# Altium schematic sheet CAMERA_DVP_FPC24_OV26407670.SchDoc
size A3; SheetNumber: 8; SheetTotal: 27
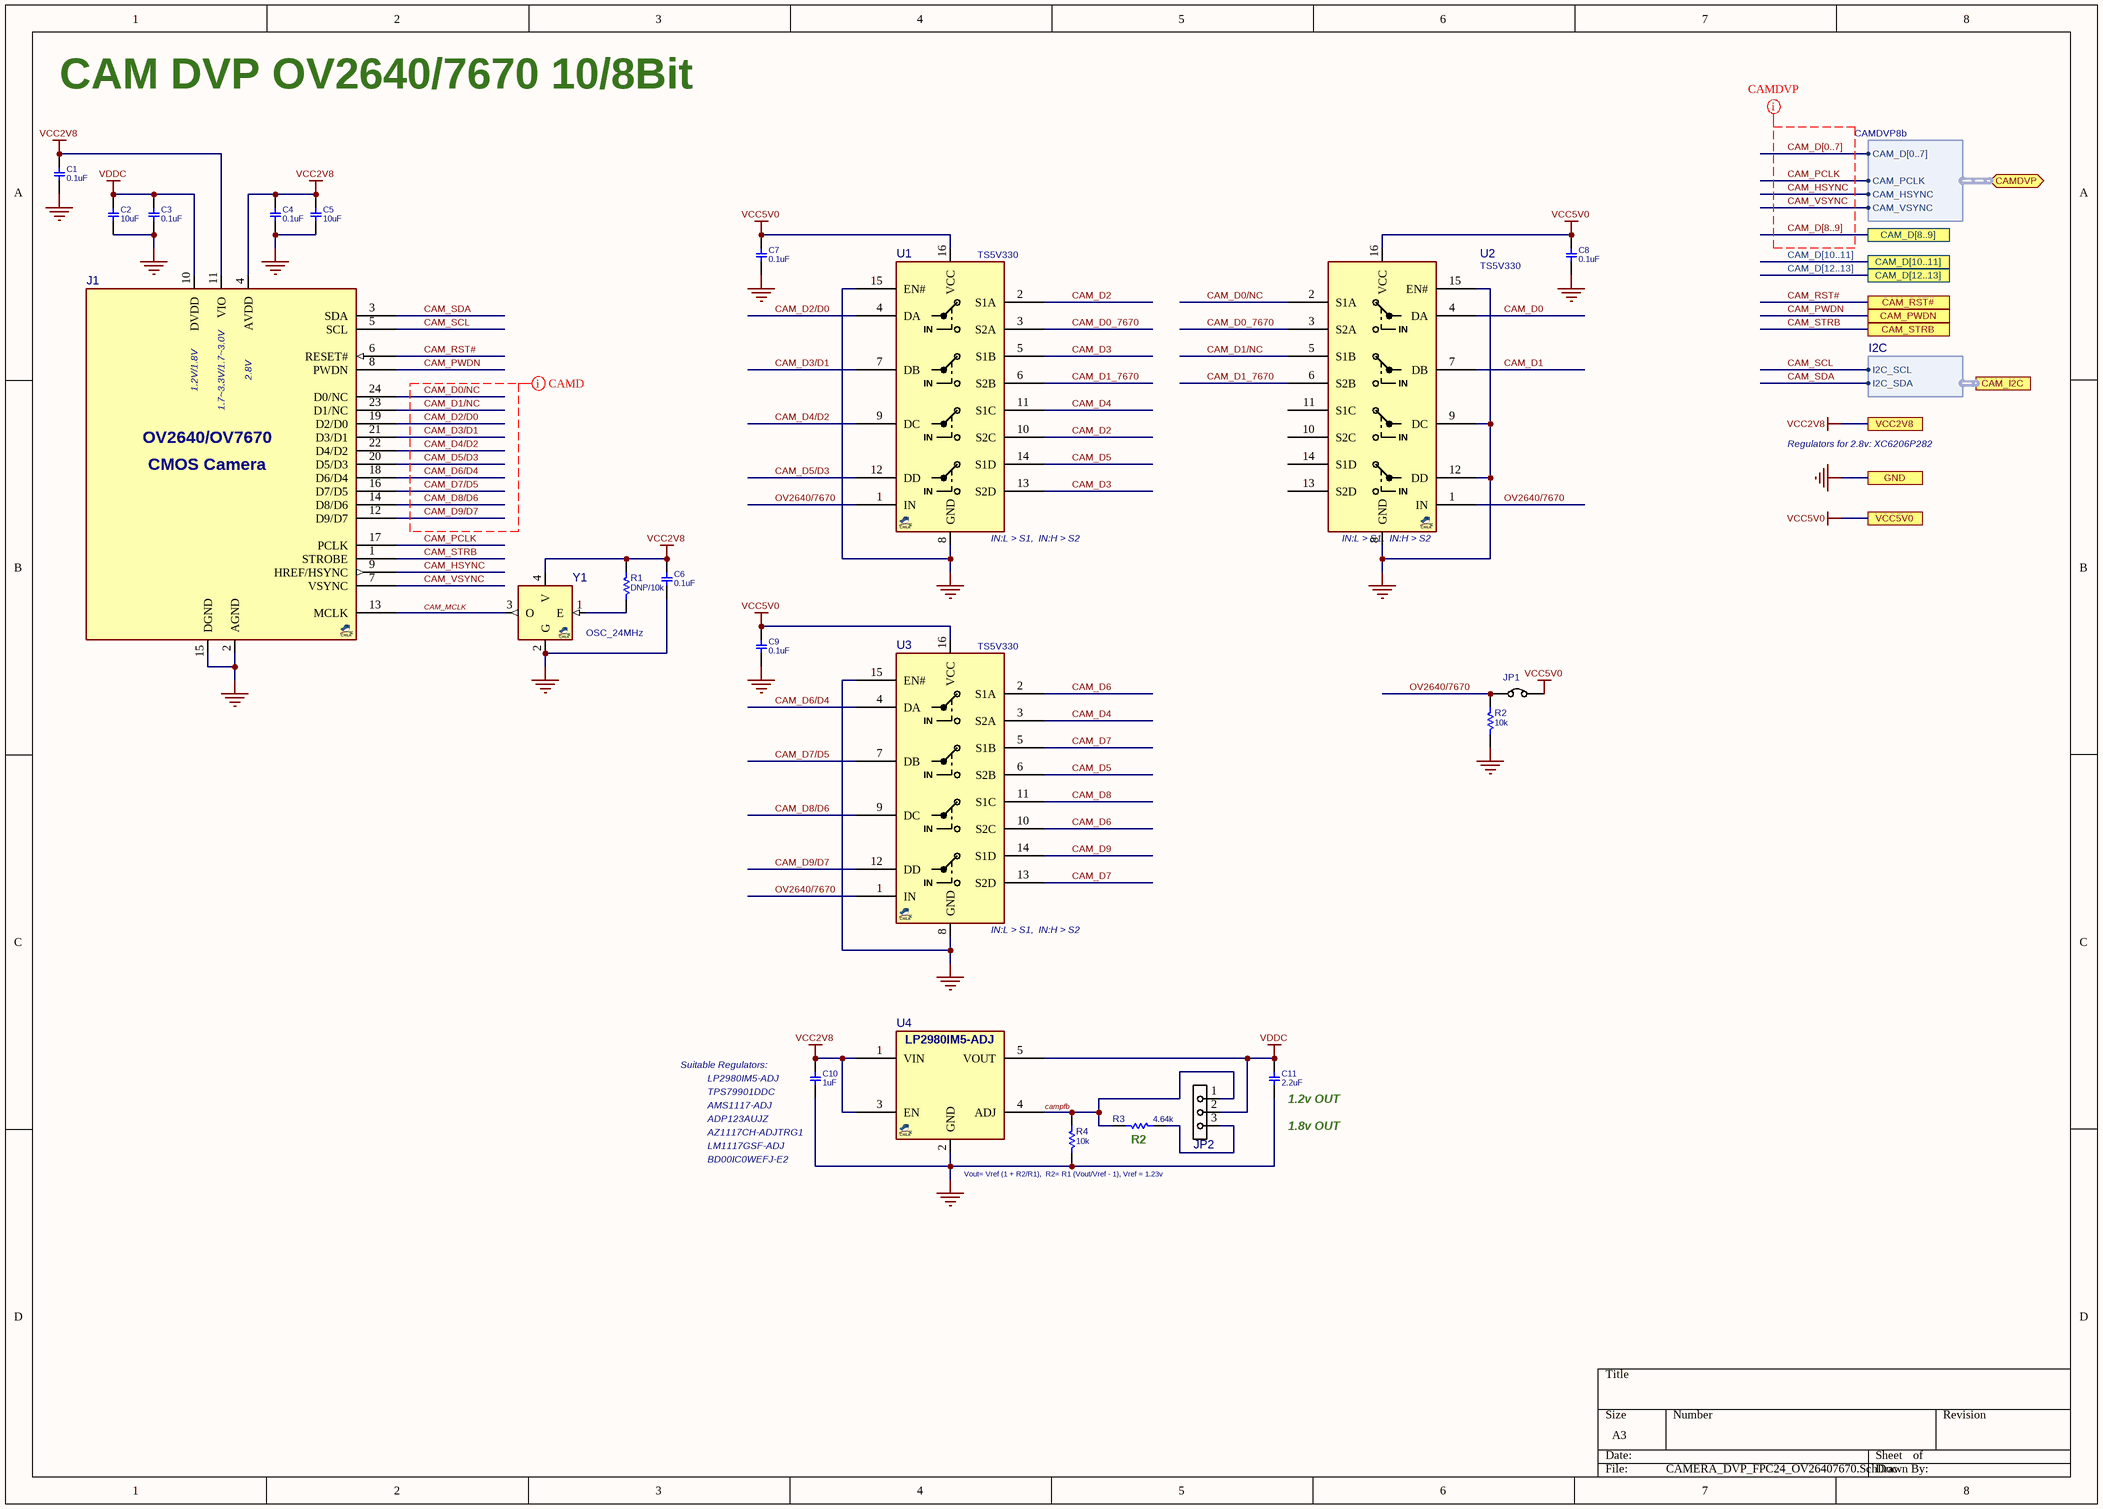
[diagram p0: CAMERA_DVP_FPC24_OV26407670.SchDoc]

## Parts
C1  0.1uF  [C0402]
C2  10uF  [C0402]
C3  0.1uF  [C0402]
C4  0.1uF  [C0402]
C5  10uF  [C0402]
C6  0.1uF  [C0402]
C7  0.1uF  [C0402]
C8  0.1uF  [C0402]
C9  0.1uF  [C0402]
C10  1uF  [C0402]
C11  2.2uF  [C0402]
J1  OV2640/7670  [FPC50_24]  (value not drawn)
JP1  JMPHDR2PIN  [JP_60X100]  (value not drawn)
JP2  JPSOLDER  [JP_3_60W]  (value not drawn)
R1  DNP/10k  [R0402]
R2  10k  [R0402]
R3  4.64k  [R0402]
R4  10k  [R0402]
U1  TS5V330  [SOG65_16]
U2  TS5V330  [SOG65_16]
U3  TS5V330  [SOG65_16]
U4  LP2980IM5-ADJ  [SOT23_5]  (value not drawn)
Y1  OSC_24MHz  [XTL_4_3225GEN]

## Ports
CAM_D[8..9], CAM_D[10..11], CAM_D[12..13], CAM_I2C (harness I2C), CAM_PWDN, CAM_RST#, CAM_STRB, CAMDVP (bidir, harness CAMDVP8b), GND, VCC2V8, VCC5V0

## Harnesses
CAMDVP8b: CAM_D[0..7], CAM_PCLK, CAM_HSYNC, CAM_VSYNC
I2C: I2C_SCL, I2C_SDA

## Nets
GND: C1.2 C2.2 C3.2 C4.2 C5.2 C6.2 C7.2 C8.2 C9.2 C10.2 C11.2 J1.2(AGND) J1.15(DGND) R2.2 R4.2 U1.8(GND) U1.15(EN#) U2.8(GND) U2.9(DC) U2.12(DD) U2.15(EN#) U3.8(GND) U3.15(EN#) U4.2(GND) Y1.2(G) ; port GND
VCC2V8: C1.1 C4.1 C5.1 C6.1 C10.1 J1.4(AVDD) J1.11(VIO) R1.1 U4.1(VIN) U4.3(EN) Y1.4(V) ; port VCC2V8
VCC5V0: C7.1 C8.1 C9.1 JP1.2 U1.16(VCC) U2.16(VCC) U3.16(VCC) ; port VCC5V0
VDDC: C2.1 C3.1 C11.1 J1.10(DVDD) JP2.2 U4.5(VOUT)
CAM_D0: U2.4(DA)
CAM_D0/NC: J1.24(D0/NC) U2.2(S1A)
CAM_D0_7670: U1.3(S2A) U2.3(S2A)
CAM_D1: U2.7(DB)
CAM_D1/NC: J1.23(D1/NC) U2.5(S1B)
CAM_D1_7670: U1.6(S2B) U2.6(S2B)
CAM_D2: U1.2(S1A) U1.10(S2C)
CAM_D2/D0: J1.19(D2/D0) U1.4(DA)
CAM_D3: U1.5(S1B) U1.13(S2D)
CAM_D3/D1: J1.21(D3/D1) U1.7(DB)
CAM_D4: U1.11(S1C) U3.3(S2A)
CAM_D4/D2: J1.22(D4/D2) U1.9(DC)
CAM_D5: U1.14(S1D) U3.6(S2B)
CAM_D5/D3: J1.20(D5/D3) U1.12(DD)
CAM_D6: U3.2(S1A) U3.10(S2C)
CAM_D6/D4: J1.18(D6/D4) U3.4(DA)
CAM_D7: U3.5(S1B) U3.13(S2D)
CAM_D7/D5: J1.16(D7/D5) U3.7(DB)
CAM_D8: U3.11(S1C)
CAM_D8/D6: J1.14(D8/D6) U3.9(DC)
CAM_D9: U3.14(S1D)
CAM_D9/D7: J1.12(D9/D7) U3.12(DD)
CAM_HSYNC: J1.9(HREF/HSYNC) ; port CAMDVP.CAM_HSYNC
CAM_MCLK: J1.13(MCLK) Y1.3(O)
CAM_PCLK: J1.17(PCLK) ; port CAMDVP.CAM_PCLK
CAM_PWDN: J1.8(PWDN) ; port CAM_PWDN
CAM_RST#: J1.6(RESET#) ; port CAM_RST#
CAM_SCL: J1.5(SCL) ; port CAM_I2C.I2C_SCL
CAM_SDA: J1.3(SDA) ; port CAM_I2C.I2C_SDA
CAM_STRB: J1.1(STROBE) ; port CAM_STRB
CAM_VSYNC: J1.7(VSYNC) ; port CAMDVP.CAM_VSYNC
campfb: JP2.1 R3.2 R4.1 U4.4(ADJ)
OV2640/7670: JP1.1 R2.1 U1.1(IN) U2.1(IN) U3.1(IN)
NetJP2_3: JP2.3 R3.1
NetR1_2: R1.2 Y1.1(E)

Not connected (* = marked no-connect by the designer): U2 10(S2C) 11(S1C) 13(S2D) 14(S1D)

## Buses and harness runs
bus CAM_D[0..7]
bus CAM_D[8..9] = port CAM_D[8..9]
bus CAM_D[10..11] = port CAM_D[10..11]
bus CAM_D[12..13] = port CAM_D[12..13]

## Layout directives
net class CAMDVP: CAM_D[0..7], CAM_D[8..9], CAM_HSYNC, CAM_PCLK, CAM_VSYNC
net class CAMD: CAM_D0/NC, CAM_D1/NC, CAM_D2/D0, CAM_D3/D1, CAM_D4/D2, CAM_D5/D3, CAM_D6/D4, CAM_D7/D5, CAM_D8/D6, CAM_D9/D7

## Notes on the sheet
- CAM DVP OV2640/7670 10/8Bit
- Regulators for 2.8v: XC6206P282
- (near U1) IN:L > S1,  IN:H > S2
- (near U2) IN:L > S1,  IN:H > S2
- (near U3) IN:L > S1,  IN:H > S2
- (near C10) Suitable Regulators:
- (near C10) LP2980IM5-ADJ
- TPS79901DDC
- AMS1117-ADJ
- ADP123AUJZ
- (near C11) 1.2v OUT
- (near C11) 1.8v OUT
- (near C10) AZ1117CH-ADJTRG1
- LM1117GSF-ADJ
- BD00IC0WEFJ-E2
- Vout= Vref (1 + R2/R1),  R2= R1 (Vout/Vref - 1), Vref = 1.23v
- (near R3) R2
- (in symbol OV2640_7670_FPC24) 1.2V/1.8V; 1.7~3.3V/1.7~3.0V; 2.8V; OV2640/OV7670; CMOS Camera

## Library data of the parts
C1-C11 = CAP_SMD_MLCC_100n50TDK: CAP, MLCC; PARAM2: 50V; PARAM: -; MANF_P#: -; MANF: -; ASSEMBLY: ASSEMBLY; PRICE: -
  C1 C3 C4 C6-C9: VALUE: 0.1uF
  C2 C5: VALUE: 10uF
  C10: VALUE: 1uF
  C11: VALUE: 2.2uF
J1 = OV2640_7670_FPC24: Camera Module, Color, DVP FPC24; VALUE: OV2640/7670; MANF_P#: OV2640/7670; PARAM2: -; PARAM: -
JP1 = JUMPER_HDR_2P: JUMPER, HEADER 2PIN; MANF: MANF; MANF_P#: MANF_P#; VALUE: JMPHDR2PIN
JP2 = JUMPER_HDR_3P: JUMPER, HEADER 3PIN; MANF: MANF; MANF_P#: MANF_P#; VALUE: JPSOLDER
R1-R4 = RES_SMD_1K_0402YK: RESISTOR, SMD, THICK FILM, YAGEO; MANF_P#: RC0402FR-071KL; PARAM: 0.063W; DESC: DESCRIPTION; DIST#: MOUSER; PARAM2: 1%; MANF: Yageo; ASSEMBLY: ASSEMBLY; PRICE: 100= 0.3$
  R1: VALUE: DNP/10k
  R2 R4: VALUE: 10k
  R3: VALUE: 4.64k
U1-U3 = BCT4157_SC70_1: IC, SWITCH, Analog, SPDT, SC-70-6; MANF: TI; MANF_P#: TS5V330PW; PARAM2: 5V, 300MHz BW; PARAM: 3Ohm Ron, 6ns, -40~85oC; PRICE: 0.05$; VALUE: TS5V330
U4 = VREG_LP2980_SOT23: REG, Linear, LDO0.12V, Adj, 50mA, VIN2.5~16V; MANF: Texas Instruments; PARAM2: 2.5~16VIN, 1.23~15VOUT; PARAM: LDO0.12V, 50mA, -40~125°C; MANF_P#: LP2980IM5-ADJ; PRICE: 1.3$; VALUE: LP2980IM5-ADJ
Y1 = OSC_4_25MHz_3225E: CLOCK OSCILLATOR, 25MHz, 10PPM, 3.2X2.5mm; MANF: ECS; PARAM: 10PPM, 15pF, -40~85oC; DESC: DESCRIPTION; DIST#: MOUSER; PARAM2: 1.8~3.3V; MANF_P#: OT322524MJBA4SL; ASSEMBLY: ASSEMBLY; PRICE: 1= 1.2$; Value: OSC_24MHz